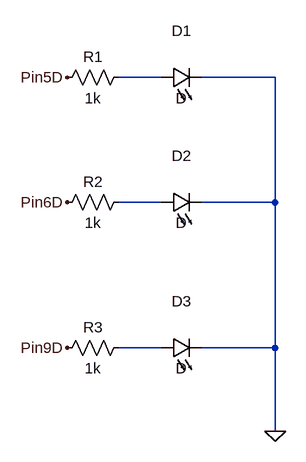
[diagram p0: schematic Schematic.asc]
Schematic.asc, the LTspice schematic file:
Version 4
SHEET 1 880 680
WIRE 384 96 320 96
WIRE 560 96 448 96
WIRE 384 288 320 288
WIRE 560 288 560 96
WIRE 560 288 448 288
WIRE 384 512 320 512
WIRE 560 512 560 288
WIRE 560 512 448 512
WIRE 560 640 560 512
FLAG 560 640 0
FLAG 240 96 Pin5D
FLAG 240 288 Pin6D
FLAG 240 512 Pin9D
SYMBOL res 336 80 R90
WINDOW 0 0 56 VBottom 2
WINDOW 3 32 56 VTop 2
SYMATTR InstName R1
SYMATTR Value 1k
SYMBOL res 336 272 R90
WINDOW 0 0 56 VBottom 2
WINDOW 3 32 56 VTop 2
SYMATTR InstName R2
SYMATTR Value 1k
SYMBOL res 336 496 R90
WINDOW 0 0 56 VBottom 2
WINDOW 3 32 56 VTop 2
SYMATTR InstName R3
SYMATTR Value 1k
SYMBOL LED 384 112 R270
WINDOW 0 72 32 VTop 2
WINDOW 3 0 32 VBottom 2
SYMATTR InstName D1
SYMBOL LED 384 304 R270
WINDOW 0 72 32 VTop 2
WINDOW 3 0 32 VBottom 2
SYMATTR InstName D2
SYMBOL LED 384 528 R270
WINDOW 0 72 32 VTop 2
WINDOW 3 0 32 VBottom 2
SYMATTR InstName D3

The netlist it stands for:
* Schematic.asc
R1 N001 Pin5D 1k
R2 N002 Pin6D 1k
R3 N003 Pin9D 1k
D1 N001 0 D
D2 N002 0 D
D3 N003 0 D
.model D D
.lib standard.dio
.backanno
.end